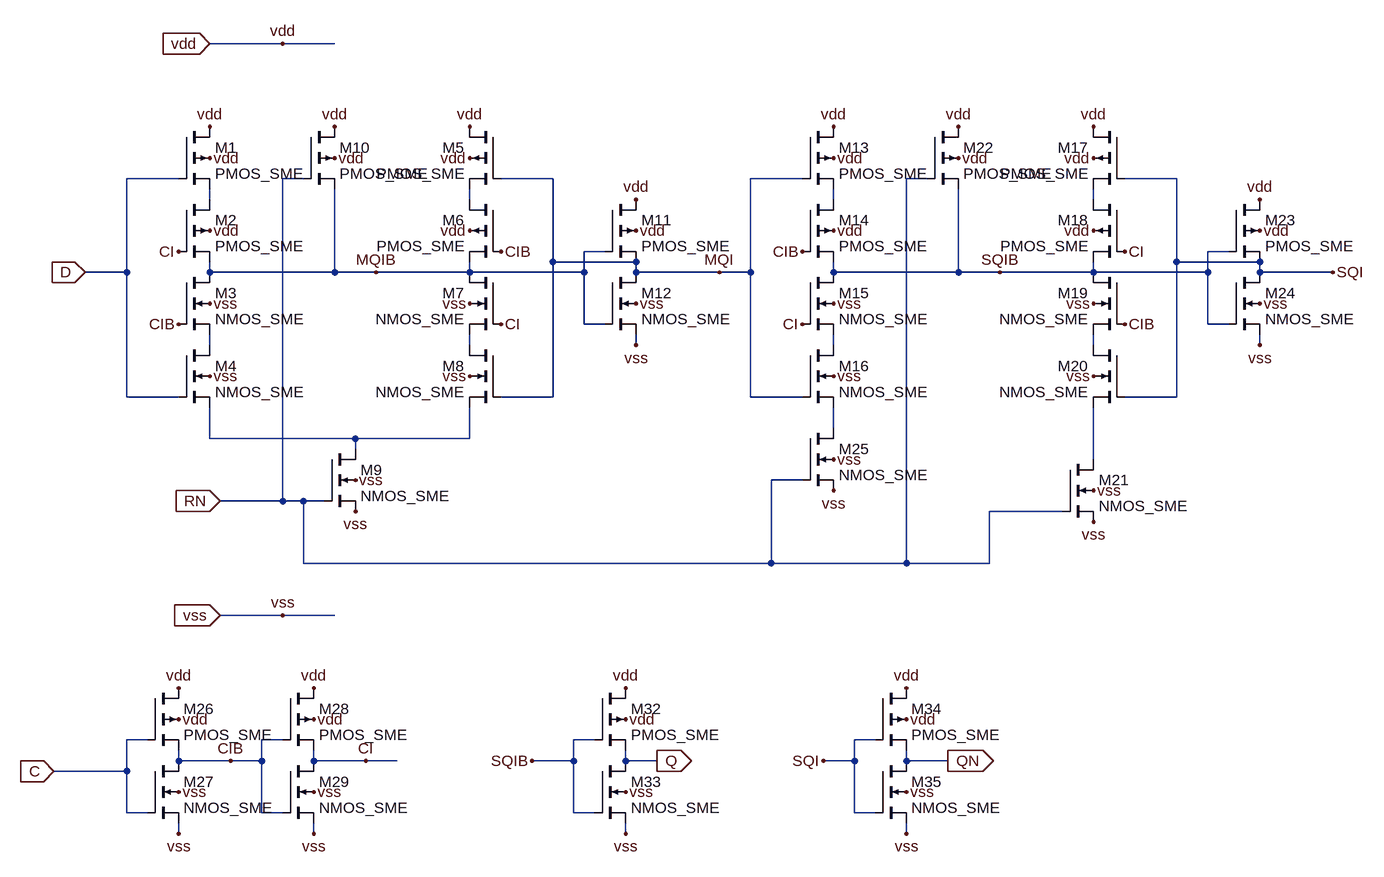
[diagram p0: schematic DFRRLHDX1.asc]
DFRRLHDX1.asc, the LTspice schematic file:
Version 4.1
SHEET 1 1900 1284
WIRE 224 -16 112 -16
WIRE 304 -16 224 -16
WIRE 64 192 -16 192
WIRE 256 192 224 192
WIRE 640 192 560 192
WIRE 1024 192 944 192
WIRE 1216 192 1184 192
WIRE 1600 192 1520 192
WIRE 112 224 112 208
WIRE 512 224 512 208
WIRE 1072 224 1072 208
WIRE 1472 224 1472 208
WIRE 720 304 688 304
WIRE 1680 304 1648 304
WIRE 640 320 640 192
WIRE 768 320 640 320
WIRE 1600 320 1600 192
WIRE 1728 320 1600 320
WIRE -16 336 -16 192
WIRE -16 336 -80 336
WIRE 112 336 112 320
WIRE 304 336 304 208
WIRE 304 336 112 336
WIRE 368 336 304 336
WIRE 512 336 512 320
WIRE 512 336 368 336
WIRE 688 336 688 304
WIRE 688 336 512 336
WIRE 768 336 768 320
WIRE 896 336 768 336
WIRE 944 336 944 192
WIRE 944 336 896 336
WIRE 1072 336 1072 320
WIRE 1264 336 1264 208
WIRE 1264 336 1072 336
WIRE 1328 336 1264 336
WIRE 1472 336 1472 320
WIRE 1472 336 1328 336
WIRE 1648 336 1648 304
WIRE 1648 336 1472 336
WIRE 1728 336 1728 320
WIRE 1840 336 1728 336
WIRE 688 416 688 336
WIRE 720 416 688 416
WIRE 1648 416 1648 336
WIRE 1680 416 1648 416
WIRE 112 448 112 432
WIRE 512 448 512 432
WIRE 768 448 768 432
WIRE 1072 448 1072 432
WIRE 1472 448 1472 432
WIRE 1728 448 1728 432
WIRE -16 528 -16 336
WIRE 64 528 -16 528
WIRE 640 528 640 320
WIRE 640 528 560 528
WIRE 944 528 944 336
WIRE 1024 528 944 528
WIRE 1600 528 1600 320
WIRE 1600 528 1520 528
WIRE 1072 576 1072 544
WIRE 112 592 112 544
WIRE 336 592 112 592
WIRE 512 592 512 544
WIRE 512 592 336 592
WIRE 336 608 336 592
WIRE 1472 624 1472 544
WIRE 1024 656 976 656
WIRE 224 688 224 192
WIRE 224 688 128 688
WIRE 256 688 224 688
WIRE 288 688 256 688
WIRE 1424 704 1312 704
WIRE 256 784 256 688
WIRE 976 784 976 656
WIRE 976 784 256 784
WIRE 1184 784 1184 192
WIRE 1184 784 976 784
WIRE 1312 784 1312 704
WIRE 1312 784 1184 784
WIRE 224 864 128 864
WIRE 304 864 224 864
WIRE 16 1056 -16 1056
WIRE 224 1056 192 1056
WIRE 704 1056 672 1056
WIRE 1136 1056 1104 1056
WIRE 64 1088 64 1072
WIRE 144 1088 64 1088
WIRE 192 1088 192 1056
WIRE 192 1088 144 1088
WIRE 272 1088 272 1072
WIRE 352 1088 272 1088
WIRE 400 1088 352 1088
WIRE 672 1088 672 1056
WIRE 672 1088 608 1088
WIRE 752 1088 752 1072
WIRE 800 1088 752 1088
WIRE 1104 1088 1104 1056
WIRE 1104 1088 1056 1088
WIRE 1184 1088 1184 1072
WIRE 1248 1088 1184 1088
WIRE -16 1104 -16 1056
WIRE -16 1104 -128 1104
WIRE -16 1168 -16 1104
WIRE 16 1168 -16 1168
WIRE 192 1168 192 1088
WIRE 224 1168 192 1168
WIRE 672 1168 672 1088
WIRE 704 1168 672 1168
WIRE 1104 1168 1104 1088
WIRE 1136 1168 1104 1168
WIRE 64 1200 64 1184
WIRE 272 1200 272 1184
WIRE 752 1200 752 1184
WIRE 1184 1200 1184 1184
FLAG 112 160 vdd
FLAG 112 272 vdd
FLAG 112 112 vdd
FLAG 112 384 vss
FLAG 112 496 vss
FLAG -80 336 D
IOPIN -80 336 In
FLAG 64 304 CI
FLAG 64 416 CIB
FLAG 512 160 vdd
FLAG 512 272 vdd
FLAG 512 112 vdd
FLAG 512 384 vss
FLAG 512 496 vss
FLAG 560 304 CIB
FLAG 560 416 CI
FLAG 336 656 vss
FLAG 128 688 RN
IOPIN 128 688 In
FLAG 336 704 vss
FLAG 304 160 vdd
FLAG 304 112 vdd
FLAG 368 336 MQIB
FLAG 768 272 vdd
FLAG 768 384 vss
FLAG 768 224 vdd
FLAG 768 448 vss
FLAG 1072 160 vdd
FLAG 1072 272 vdd
FLAG 1072 112 vdd
FLAG 1072 384 vss
FLAG 1072 496 vss
FLAG 1024 304 CIB
FLAG 1024 416 CI
FLAG 1472 160 vdd
FLAG 1472 272 vdd
FLAG 1472 112 vdd
FLAG 1472 384 vss
FLAG 1472 496 vss
FLAG 1520 304 CI
FLAG 1520 416 CIB
FLAG 1472 672 vss
FLAG 1472 720 vss
FLAG 1264 160 vdd
FLAG 1264 112 vdd
FLAG 1328 336 SQIB
FLAG 1728 272 vdd
FLAG 1728 384 vss
FLAG 1728 224 vdd
FLAG 1728 448 vss
FLAG 896 336 MQI
FLAG 1840 336 SQI
FLAG 1072 624 vss
FLAG 1072 672 vss
FLAG 64 1024 vdd
FLAG 64 1136 vss
FLAG 64 976 vdd
FLAG 64 1200 vss
FLAG -128 1104 C
IOPIN -128 1104 In
FLAG 272 1024 vdd
FLAG 272 1136 vss
FLAG 272 976 vdd
FLAG 272 1200 vss
FLAG 752 1024 vdd
FLAG 752 1136 vss
FLAG 752 976 vdd
FLAG 752 1200 vss
FLAG 1184 1024 vdd
FLAG 1184 1136 vss
FLAG 1184 976 vdd
FLAG 1184 1200 vss
FLAG 144 1088 CIB
FLAG 352 1088 CI
FLAG 800 1088 Q
IOPIN 800 1088 Out
FLAG 1248 1088 QN
IOPIN 1248 1088 Out
FLAG 608 1088 SQIB
FLAG 1056 1088 SQI
FLAG 128 864 vss
IOPIN 128 864 In
FLAG 112 -16 vdd
IOPIN 112 -16 In
FLAG 224 -16 vdd
FLAG 224 864 vss
SYMBOL pmos4 64 112 R0
SYMATTR InstName M1
SYMATTR Value2 l=350n w=1u
SYMATTR Value PMOS_SME
SYMBOL pmos4 64 224 R0
SYMATTR InstName M2
SYMATTR Value2 l=350n w=1u
SYMATTR Value PMOS_SME
SYMBOL nmos4 64 336 R0
SYMATTR InstName M3
SYMATTR Value2 l=350n w=700n
SYMATTR Value NMOS_SME
SYMBOL nmos4 64 448 R0
SYMATTR InstName M4
SYMATTR Value2 l=350n w=700n
SYMATTR Value NMOS_SME
SYMBOL pmos4 560 112 M0
SYMATTR InstName M5
SYMATTR Value2 l=350n w=500n
SYMATTR Value PMOS_SME
SYMBOL pmos4 560 224 M0
SYMATTR InstName M6
SYMATTR Value2 l=350n w=500n
SYMATTR Value PMOS_SME
SYMBOL nmos4 560 336 M0
SYMATTR InstName M7
SYMATTR Value2 l=350n w=500n
SYMATTR Value NMOS_SME
SYMBOL nmos4 560 448 M0
SYMATTR InstName M8
SYMATTR Value2 l=350n w=500n
SYMATTR Value NMOS_SME
SYMBOL nmos4 288 608 R0
SYMATTR InstName M9
SYMATTR Value2 l=350n w=700n
SYMATTR Value NMOS_SME
SYMBOL pmos4 256 112 R0
SYMATTR InstName M10
SYMATTR Value2 l=350n w=1u
SYMATTR Value PMOS_SME
SYMBOL pmos4 720 224 R0
SYMATTR InstName M11
SYMATTR Value2 l=350n w=1u
SYMATTR Value PMOS_SME
SYMBOL nmos4 720 336 R0
SYMATTR InstName M12
SYMATTR Value2 l=350n w=700n
SYMATTR Value NMOS_SME
SYMBOL pmos4 1024 112 R0
SYMATTR InstName M13
SYMATTR Value2 l=350n w=900n
SYMATTR Value PMOS_SME
SYMBOL pmos4 1024 224 R0
SYMATTR InstName M14
SYMATTR Value2 l=350n w=900n
SYMATTR Value PMOS_SME
SYMBOL nmos4 1024 336 R0
SYMATTR InstName M15
SYMATTR Value2 l=350n w=700n
SYMATTR Value NMOS_SME
SYMBOL nmos4 1024 448 R0
SYMATTR InstName M16
SYMATTR Value2 l=350n w=700n
SYMATTR Value NMOS_SME
SYMBOL pmos4 1520 112 M0
SYMATTR InstName M17
SYMATTR Value2 l=350n w=500n
SYMATTR Value PMOS_SME
SYMBOL pmos4 1520 224 M0
SYMATTR InstName M18
SYMATTR Value2 l=350n w=500n
SYMATTR Value PMOS_SME
SYMBOL nmos4 1520 336 M0
SYMATTR InstName M19
SYMATTR Value2 l=350n w=500n
SYMATTR Value NMOS_SME
SYMBOL nmos4 1520 448 M0
SYMATTR InstName M20
SYMATTR Value2 l=350n w=500n
SYMATTR Value NMOS_SME
SYMBOL nmos4 1424 624 R0
SYMATTR InstName M21
SYMATTR Value2 l=350n w=550n
SYMATTR Value NMOS_SME
SYMBOL pmos4 1216 112 R0
SYMATTR InstName M22
SYMATTR Value2 l=350n w=1u
SYMATTR Value PMOS_SME
SYMBOL pmos4 1680 224 R0
SYMATTR InstName M23
SYMATTR Value2 l=350n w=1u
SYMATTR Value PMOS_SME
SYMBOL nmos4 1680 336 R0
SYMATTR InstName M24
SYMATTR Value2 l=350n w=700n
SYMATTR Value NMOS_SME
SYMBOL nmos4 1024 576 R0
SYMATTR InstName M25
SYMATTR Value2 l=350n w=700n
SYMATTR Value NMOS_SME
SYMBOL pmos4 16 976 R0
SYMATTR InstName M26
SYMATTR Value2 l=350n w=1u
SYMATTR Value PMOS_SME
SYMBOL nmos4 16 1088 R0
SYMATTR InstName M27
SYMATTR Value2 l=350n w=700n
SYMATTR Value NMOS_SME
SYMBOL pmos4 224 976 R0
SYMATTR InstName M28
SYMATTR Value2 l=350n w=1u
SYMATTR Value PMOS_SME
SYMBOL nmos4 224 1088 R0
SYMATTR InstName M29
SYMATTR Value2 l=350n w=700n
SYMATTR Value NMOS_SME
SYMBOL pmos4 704 976 R0
SYMATTR InstName M32
SYMATTR Value2 l=350n w=1u
SYMATTR Value PMOS_SME
SYMBOL nmos4 704 1088 R0
SYMATTR InstName M33
SYMATTR Value2 l=350n w=700n
SYMATTR Value NMOS_SME
SYMBOL pmos4 1136 976 R0
SYMATTR InstName M34
SYMATTR Value2 l=350n w=1u
SYMATTR Value PMOS_SME
SYMBOL nmos4 1136 1088 R0
SYMATTR InstName M35
SYMATTR Value2 l=350n w=700n
SYMATTR Value NMOS_SME

The netlist it stands for:
* DFRRLHDX1.asc
M1 vdd D N001 vdd PMOS_SME l=350n w=1u
M2 N001 CI MQIB vdd PMOS_SME l=350n w=1u
M3 MQIB CIB N005 vss NMOS_SME l=350n w=700n
M4 N005 D N010 vss NMOS_SME l=350n w=700n
M5 vdd MQI N002 vdd PMOS_SME l=350n w=500n
M6 N002 CIB MQIB vdd PMOS_SME l=350n w=500n
M7 MQIB CI N006 vss NMOS_SME l=350n w=500n
M8 N006 MQI N010 vss NMOS_SME l=350n w=500n
M9 N010 RN vss vss NMOS_SME l=350n w=700n
M10 vdd RN MQIB vdd PMOS_SME l=350n w=1u
M11 vdd MQIB MQI vdd PMOS_SME l=350n w=1u
M12 MQI MQIB vss vss NMOS_SME l=350n w=700n
M13 vdd MQI N003 vdd PMOS_SME l=350n w=900n
M14 N003 CIB SQIB vdd PMOS_SME l=350n w=900n
M15 SQIB CI N007 vss NMOS_SME l=350n w=700n
M16 N007 MQI N009 vss NMOS_SME l=350n w=700n
M17 vdd SQI N004 vdd PMOS_SME l=350n w=500n
M18 N004 CI SQIB vdd PMOS_SME l=350n w=500n
M19 SQIB CIB N008 vss NMOS_SME l=350n w=500n
M20 N008 SQI N011 vss NMOS_SME l=350n w=500n
M21 N011 RN vss vss NMOS_SME l=350n w=550n
M22 vdd RN SQIB vdd PMOS_SME l=350n w=1u
M23 vdd SQIB SQI vdd PMOS_SME l=350n w=1u
M24 SQI SQIB vss vss NMOS_SME l=350n w=700n
M25 N009 RN vss vss NMOS_SME l=350n w=700n
M26 vdd C CIB vdd PMOS_SME l=350n w=1u
M27 CIB C vss vss NMOS_SME l=350n w=700n
M28 vdd CIB CI vdd PMOS_SME l=350n w=1u
M29 CI CIB vss vss NMOS_SME l=350n w=700n
M32 vdd SQIB Q vdd PMOS_SME l=350n w=1u
M33 Q SQIB vss vss NMOS_SME l=350n w=700n
M34 vdd SQI QN vdd PMOS_SME l=350n w=1u
M35 QN SQI vss vss NMOS_SME l=350n w=700n
.model NMOS NMOS
.model PMOS PMOS
.lib standard.mos
.backanno
.end